# Altium schematic sheet 02 CPU STM32F103C8T6.SchDoc
size A4
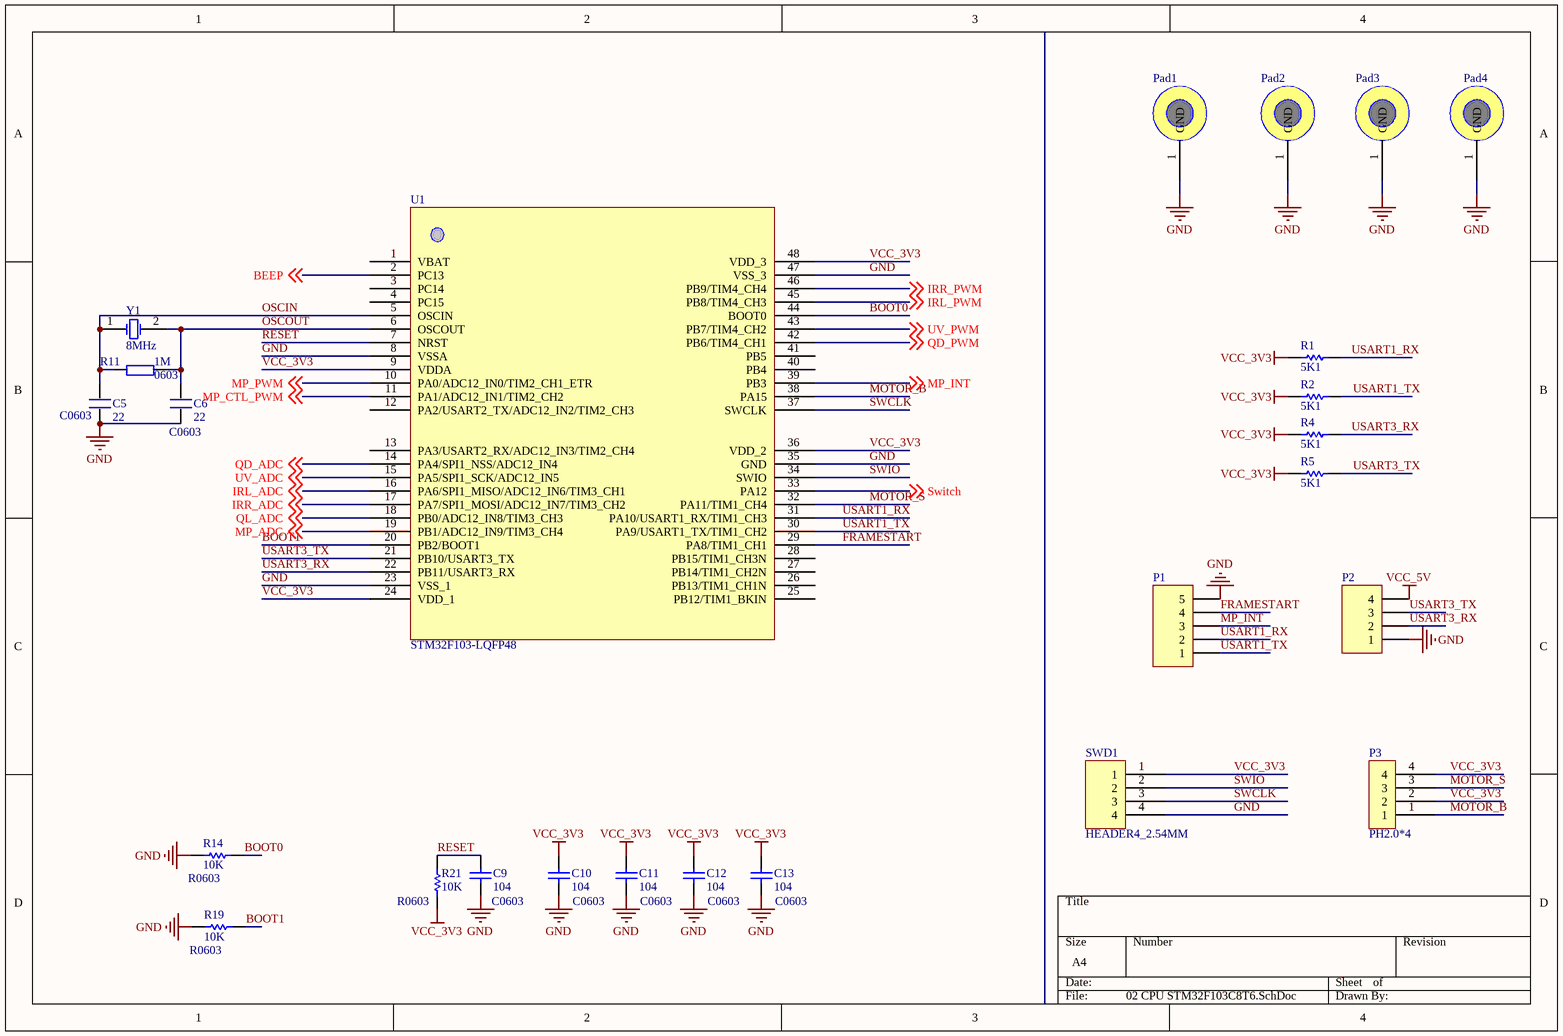
[diagram p0: 02 CPU STM32F103C8T6.SchDoc]

## Parts
C5  22  [C0603]
C6  22  [C0603]
C9  104  [C0603]
C10  104  [C0603]
C11  104  [C0603]
C12  104  [C0603]
C13  104  [C0603]
P1  (no value)  [PH2.0*5]
P2  (no value)  [PH2.0*4]
P3  PH2.0*4  [PH2.0*4]
Pad1  PAD_3.3(6.8)  [PAD_3.3(6.8)]  (value not drawn)
Pad2  PAD_3.3(6.8)  [PAD_3.3(6.8)]  (value not drawn)
Pad3  PAD_3.3(6.8)  [PAD_3.3(6.8)]  (value not drawn)
Pad4  PAD_3.3(6.8)  [PAD_3.3(6.8)]  (value not drawn)
R1  5K1  [R0603]
R2  5K1  [R0603]
R4  5K1  [R0603]
R5  5K1  [R0603]
R11  1M  footprint: 0603  [R0603]
R14  10K  [R0603]
R19  10K  [R0603]
R21  10K  [R0603]
SWD1  HEADER4_2.54MM  [HEADER4_2.54MM]
U1  STM32F103-LQFP48  [STM32F103_48P]
Y1  8MHz  [XTAL8M]

## Nets
GND: C5.1 C6.1 C9.2 C10.2 C11.2 C12.2 C13.2 P1.5 P2.1 Pad1.1(GND) Pad2.1(GND) Pad3.1(GND) Pad4.1(GND) R14.1 R19.1 SWD1.4 U1.8(VSSA) U1.23(VSS_1) U1.35(GND) U1.47(VSS_3)
VCC_3V3: C10.1 C11.1 C12.1 C13.1 P3.2 P3.4 R1.1 R2.1 R4.1 R5.1 R21.1 SWD1.1 U1.9(VDDA) U1.24(VDD_1) U1.36(VDD_2) U1.48(VDD_3)
VCC_5V: P2.4
BEEP: U1.2(PC13) ; off-sheet BEEP
BOOT0: R14.2 U1.44(BOOT0)
BOOT1: R19.2 U1.20(PB2/BOOT1)
FRAMESTART: P1.4 U1.29(PA8/TIM1_CH1)
IRL_ADC: U1.16(PA6/SPI1_MISO/ADC12_IN6/TIM3_CH1) ; off-sheet IRL_ADC
IRL_PWM: U1.45(PB8/TIM4_CH3) ; off-sheet IRL_PWM
IRR_ADC: U1.17(PA7/SPI1_MOSI/ADC12_IN7/TIM3_CH2) ; off-sheet IRR_ADC
IRR_PWM: U1.46(PB9/TIM4_CH4) ; off-sheet IRR_PWM
MOTOR_B: P3.1 U1.38(PA15)
MOTOR_S: P3.3 U1.32(PA11/TIM1_CH4)
MP_ADC: U1.19(PB1/ADC12_IN9/TIM3_CH4) ; off-sheet MP_ADC
MP_CTL_PWM: U1.11(PA1/ADC12_IN1/TIM2_CH2) ; off-sheet MP_CTL_PWM
MP_INT: P1.3 U1.39(PB3) ; off-sheet MP_INT
MP_PWM: U1.10(PA0/ADC12_IN0/TIM2_CH1_ETR) ; off-sheet MP_PWM
OSCIN: C5.2 R11.1 U1.5(OSCIN) Y1.1(OSC1)
OSCOUT: C6.2 R11.2 U1.6(OSCOUT) Y1.2(OSC2)
QD_ADC: U1.14(PA4/SPI1_NSS/ADC12_IN4) ; off-sheet QD_ADC
QD_PWM: U1.42(PB6/TIM4_CH1) ; off-sheet QD_PWM
QL_ADC: U1.18(PB0/ADC12_IN8/TIM3_CH3) ; off-sheet QL_ADC
RESET: C9.1 R21.2 U1.7(NRST)
SWCLK: SWD1.3 U1.37(SWCLK)
SWIO: SWD1.2 U1.34(SWIO)
Switch: U1.33(PA12) ; off-sheet Switch
USART1_RX: P1.2 R1.2 U1.31(PA10/USART1_RX/TIM1_CH3)
USART1_TX: P1.1 R2.2 U1.30(PA9/USART1_TX/TIM1_CH2)
USART3_RX: P2.2 R4.2 U1.22(PB11/USART3_RX)
USART3_TX: P2.3 R5.2 U1.21(PB10/USART3_TX)
UV_ADC: U1.15(PA5/SPI1_SCK/ADC12_IN5) ; off-sheet UV_ADC
UV_PWM: U1.43(PB7/TIM4_CH2) ; off-sheet UV_PWM

Not connected (* = marked no-connect by the designer): U1 1(VBAT) 3(PC14) 4(PC15) 12(PA2/USART2_TX/ADC12_IN2/TIM2_CH3) 13(PA3/USART2_RX/ADC12_IN3/TIM2_CH4) 25(PB12/TIM1_BKIN) 26(PB13/TIM1_CH1N) 27(PB14/TIM1_CH2N) 28(PB15/TIM1_CH3N) 40(PB4) 41(PB5)

## Library data of the parts
C5 C6 = C
C9 = Cap: Capacitor; Value: 100pF; Published: 8-Jun-2000; LatestRevisionDate: 17-Jul-2002; LatestRevisionNote: Re-released for DXP Platform.; PackageReference: RAD-0.3; Publisher: Altium Limited
C10-C13 = Cap: Capacitor; Manufacturer: Generic Components; Class: Passive; Value: 105; Published: 08/06/2000; Publisher: Altium Hobart Technology Centre; SubClass: Capacitor
P1 = Header 5: Header, 5-Pin; LatestRevisionDate: 17-Jul-2002; LatestRevisionNote: Re-released for DXP Platform.; Publisher: Altium Limited
P2 = Header 4: Header, 4-Pin; LatestRevisionDate: 17-Jul-2002; LatestRevisionNote: Re-released for DXP Platform.; Publisher: Altium Limited
R1 R2 R4 R5 = Res1: Resistor; Manufacturer: Generic Components; Class: Passive; Value: 5.1K; Published: 08/06/2000; Publisher: Altium Hobart Technology Centre; SubClass: Resistor
R11 = R
R14 R19 R21 = Res Semi: Semiconductor Resistor; Value: 1K; Published: 8-Jun-2000; LatestRevisionDate: 17-Jul-2002; LatestRevisionNote: Re-released for DXP Platform.; PackageReference: AXIAL-0.5; Publisher: Altium Limited
Y1 = XTAL: Crystal Oscillator; Published: 8-Jun-2000; LatestRevisionDate: 17-Jul-2002; LatestRevisionNote: Re-released for DXP Platform.; Publisher: Altium Limited